# EAGLE design hx1 (EAGLE 7.2.0)
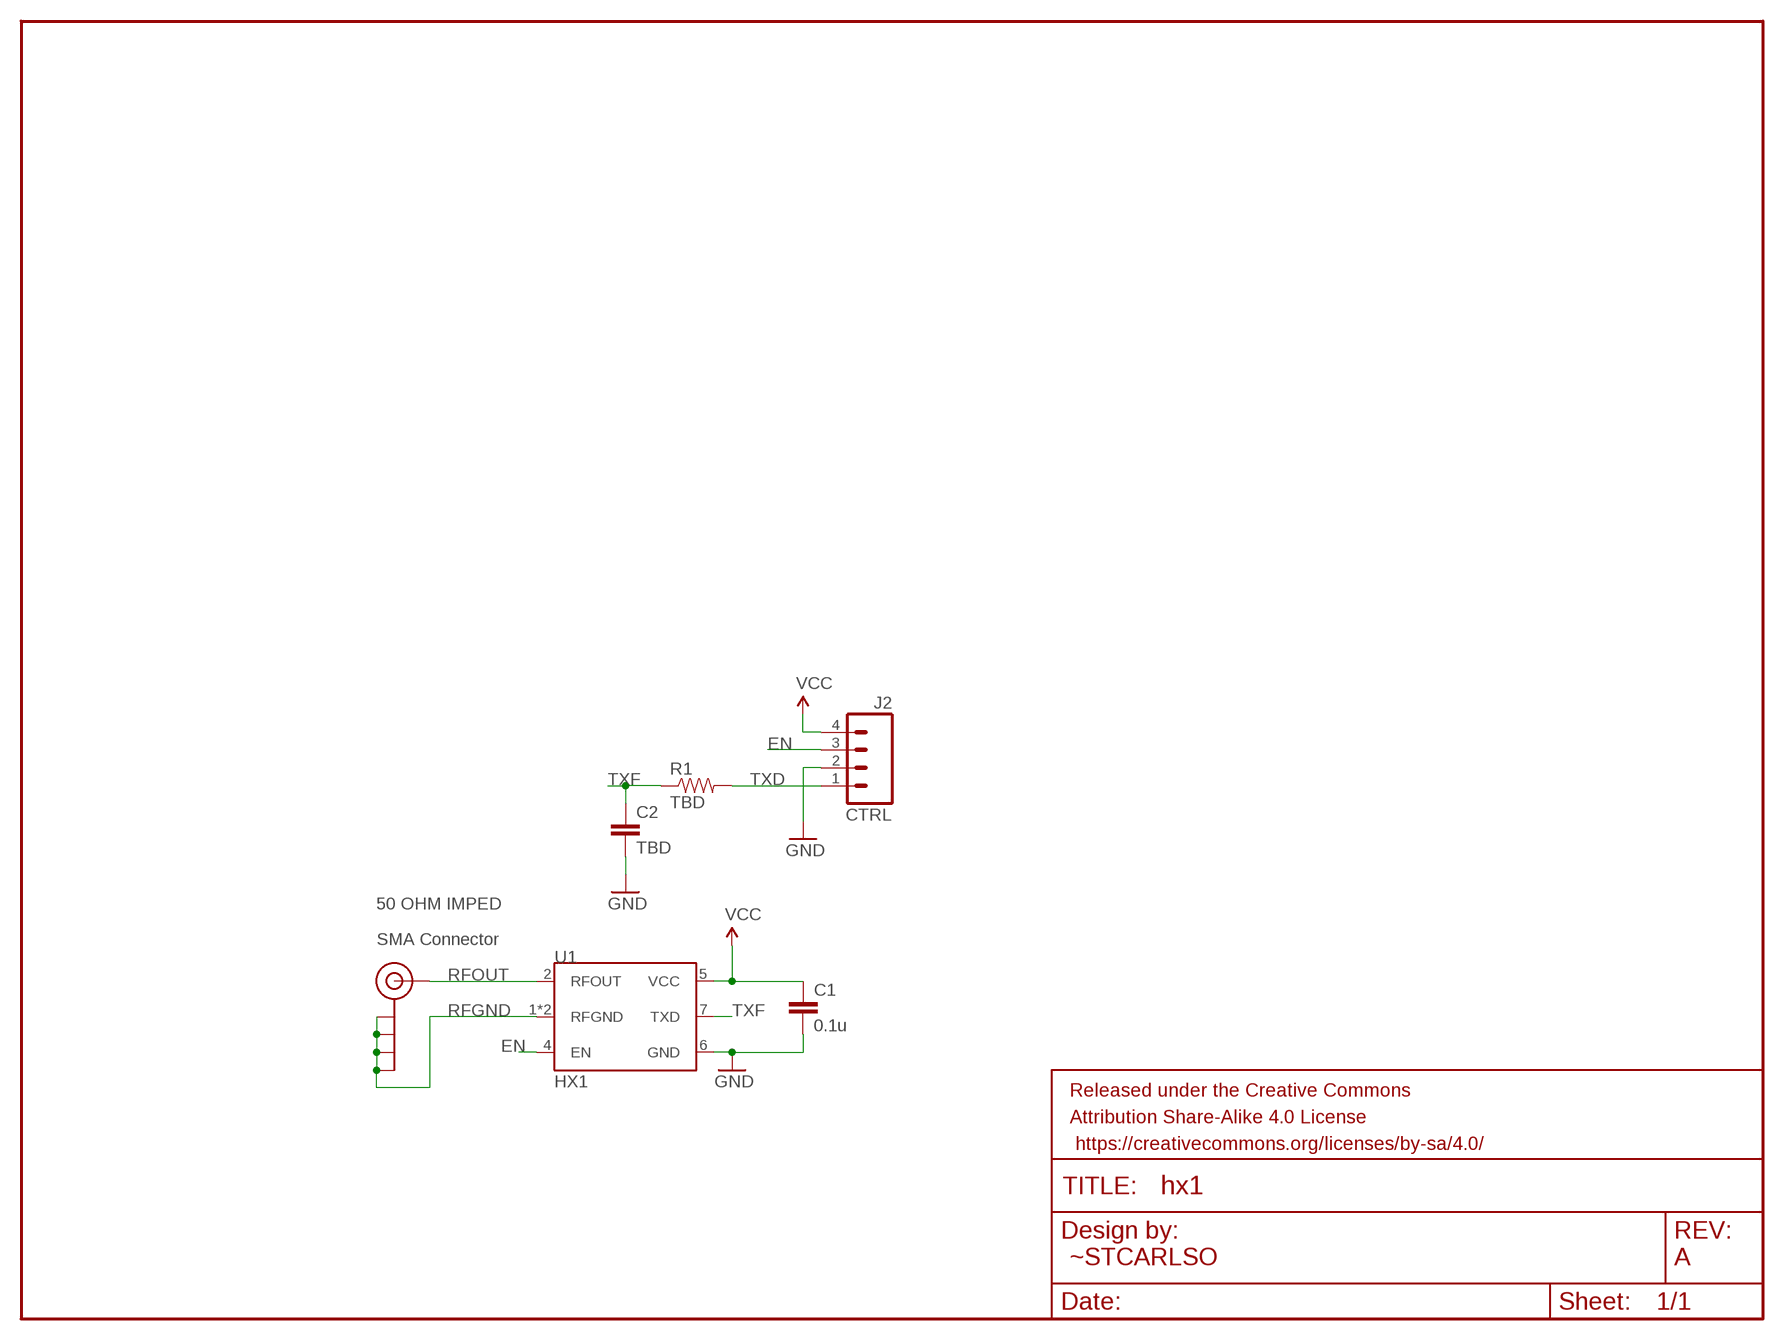
[diagram p0: schematic, sheet 1]

## Parts
C1  0.1u  CAPPTH  [CAP-PTH-SMALL]
C2  TBD  CAPPTH  [CAP-PTH-SMALL]
FRAME1  FRAME-LETTERNO_PACKAGE  [DUMMY]
J1  SMA_EDGE  [SMA-EDGE]
J2  CTRL  M04PTH  [1X04]
R1  TBD  RESISTORAXIAL-0.3  [AXIAL-0.3]
U1  HX1  [1X12]

## Nets
EN: J2.3 U1.4(EN)
GND: C1.2 C2.2 J2.2 U1.6(GND)
RFGND: J1.GND@0(GND) J1.GND@1(GND) J1.GND@2(GND) J1.GND@3(GND) U1.1(RFGND) U1.3(RFGND)
RFOUT: J1.SIG(SIGNAL) U1.2(RFOUT)
TXD: J2.1 R1.P$2
TXF: C2.1 R1.P$1 U1.7(TXD)
VCC: C1.1 J2.4 U1.5(VCC)

## Notes on the sheet
- 50 OHM IMPED
- SMA Connector
- ~STCARLSO | A

## Library data of the parts
C1 C2 = SparkFun-Passives:CAP: Capacitor Standard 0603 ceramic capacitor, and 0.1" leaded capacitor.
FRAME1 = SparkFun-Aesthetics:FRAME-LETTER: Schematic Frame Standard 8.5x11 US Letter frame; DESIGNER: Nobody; VERSION: v01
J1 = SparkFun-Connectors:SMA_EDGE: SMA Antenna Connector End launch SMA connector. The paste layer has been removed so that the connector can be hand soldered onto the board after reflow.
J2 = SparkFun-Connectors:M04: Header 4 Standard 4-pin 0.1" header. Use with straight break away headers (SKU : PRT-00116), right angle break away headers (PRT-00553), swiss pins (PRT-00743), machine pins (PRT-00117), and female headers (PRT-00115). Molex polarized connector foot print use with SKU : PRT-08231 with associated crimp pins and housings. 1MM SMD Version SKU: PRT-10208
R1 = SparkFun-Passives:RESISTOR: Resistor Basic schematic elements and footprints for 0603, 1206, and PTH resistors.
U1 = HAB:HX1: Radiometrix HX1 High-power VHF Narrow Band 300 mW Transmitter

## Board
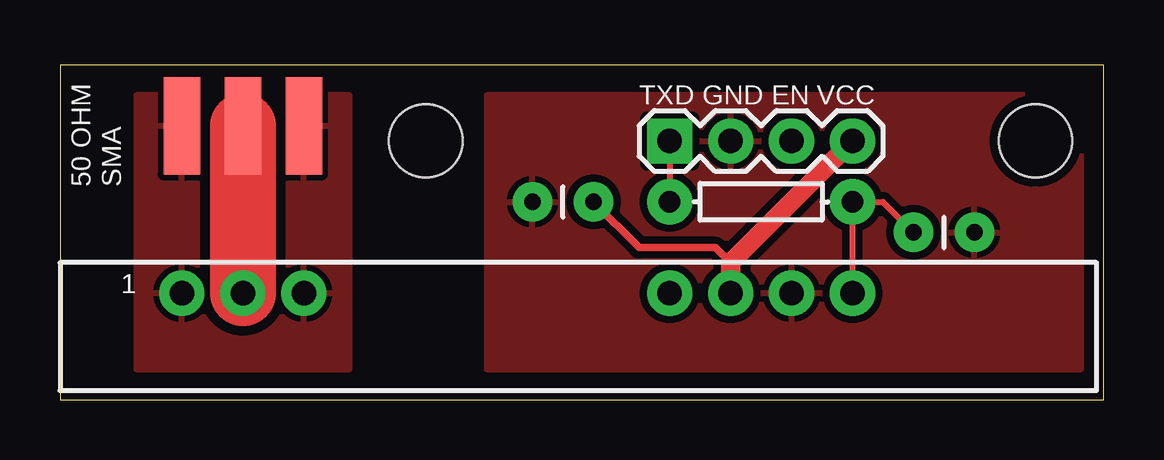
[diagram p1: board, top side]
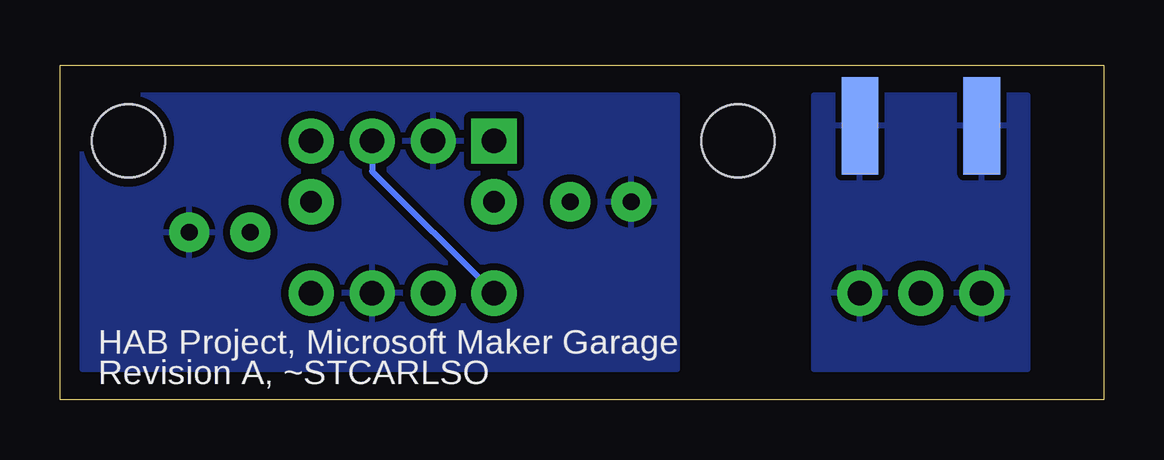
[diagram p2: board, bottom side, seen from below]

Size 43.48 x 13.96 mm. Coordinates in mm from the lower left corner, seen from the top.
Outline: 0,0 43.48,0 43.48,13.96 0,13.96 0,0
Copper layers (1*16): Top 0.0356mm / dielectric 1.5011mm / Bottom 0.0356mm
Design rules "LaenPCBOrder": minimum track width 6mil, minimum drill 13mil, track to track 6mil, track to pad 6mil, pad to pad 6mil, via to via 6mil, smd to smd 6mil, copper to edge 15mil, drill to drill 6mil, minimum pad ring 7mil, minimum via ring 7mil, stop-mask expansion 4mil, vias tented up to drill 0mil, thermal gap 10mil
Holes 3.05 mm at 40.64,10.79 15.24,10.79

### Footprints (pad centres in the part's own frame; a part is rotated, then mirrored left to right if it is on the bottom)
CAP-PTH-SMALL = drill 0.7 pad 1.651: 1 0,0; 2 2.54,0
SMA-EDGE = smd 1.524 x 4.064: GND@0 0,0; GND@1 5.08,0; SIG 2.54,0 | smd 1.524 x 4.064 bottom: GND@2 0,0; GND@3 5.08,0
1X04 = drill 1.016 pad 1.88 square: 1 0,0 | drill 1.016 pad 1.88: 2 2.54,0; 3 5.08,0; 4 7.62,0
AXIAL-0.3 = drill 0.9 pad 1.88: P$1 -3.81,0; P$2 3.81,0
1X12 = drill 1.016 pad 1.88: 1 0,0; 2 2.54,0; 3 5.08,0; 4 20.32,0; 5 22.86,0; 6 25.4,0; 7 27.94,0

### Placement (x,y rotation side)
C1  22.23,8.26 180 top
C2  35.56,6.99 0 top
FRAME1  -1.27,15.24 0 top
J1  5.08,11.43 0 top
J2  25.4,10.79 0 top
R1  29.21,8.26 180 top
U1  5.08,4.45 0 top

### Tracks (layer width: path | path; a pad name or v marks a point on that pad's centre or on a via)
EN
  Bottom 0.254: J2.3 30.48,9.53 U1.4
GND
  pour Top (isolate 0.305): 17.78,12.7 17.78,1.27 42.55,1.27 42.55,12.7
  pour Bottom (isolate 0.305): 17.78,12.7 17.78,1.27 42.55,1.27 42.55,12.7
RFGND
  pour Bottom (isolate 0.406): 3.17,12.7 3.17,1.27 12.06,1.27 12.06,12.7
  pour Top (isolate 0.406): 3.17,12.7 3.17,1.27 12.06,1.27 12.06,12.7
RFOUT
  Top 2.743: J1.SIG U1.2
TXD
  Top 0.254: J2.1 R1.P$2
TXF
  Top 0.254: C2.1 34.29,8.26 R1.P$1 U1.7
VCC
  Top 0.305: 27.94,5.71 27.3,6.35 24.13,6.35 C1.1
  Top 0.813: J2.4 27.94,5.71 U1.5

### Text on the board
tPlace: TXD GND EN VCC | 50 OHM | SMA | 1
bPlace: HAB Project, Microsoft Maker Garage | Revision A, ~STCARLSO